# EAGLE design slave_06 (EAGLE 5.08)
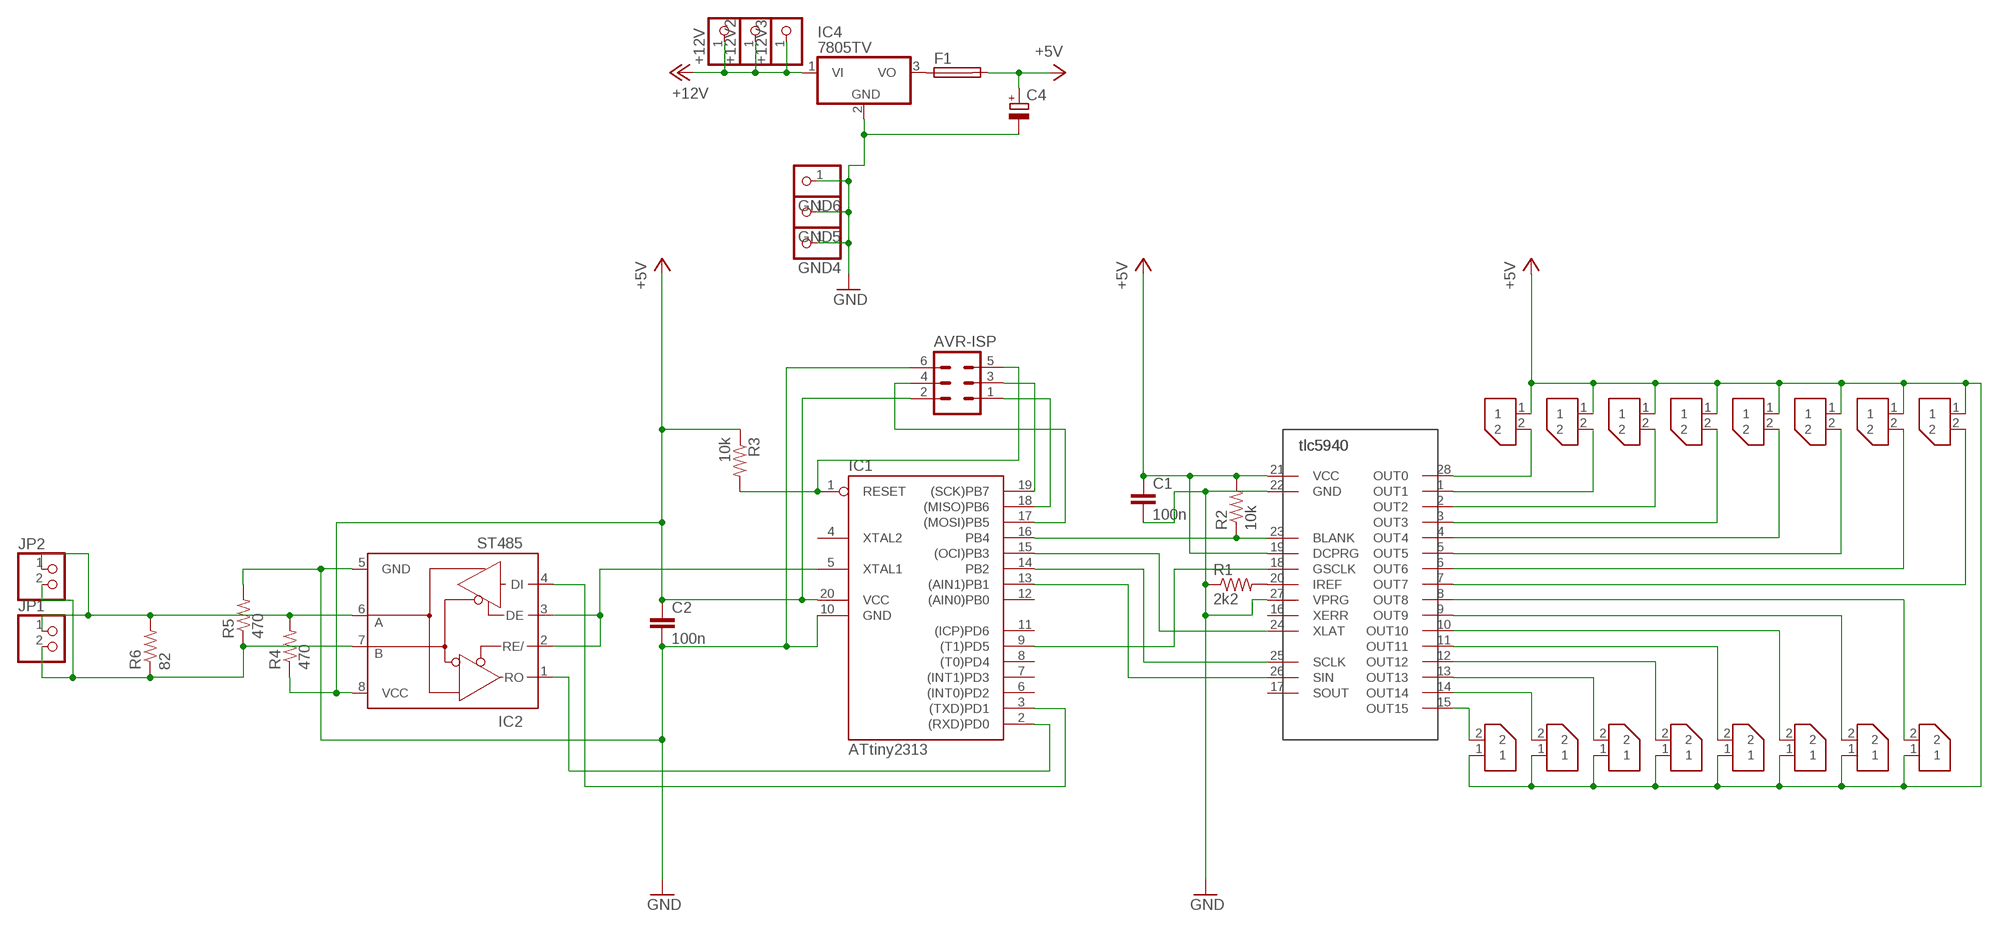
[diagram p0: schematic, sheet 1]

## Parts
+12V  PINHD-1X1  [1X01]
+12V2  PINHD-1X1  [1X01]
+12V3  PINHD-1X1  [1X01]
AVR-ISP  ML6  [ML6]
C1  100n  C7.5/3  [C7.5B3]
C2  100n  C7.5/3  [C7.5B3]
C4  CPOL-EUE5-5  [E5-5]
F1  SH22,5A  [SH22,5A]
GND4  PINHD-1X1  [1X01]
GND5  PINHD-1X1  [1X01]
GND6  PINHD-1X1  [1X01]
IC1  ATtiny2313  AT90S2313P  [DIL20]
IC2  ST485  MAX3468CPA  [DIL08]
IC4  7805TV  [TO220V]
JP1  PINHD-1X2  [1X02]
JP2  PINHD-1X2  [1X02]
R1  2k2  R-US_0204/7  [0204/7]
R2  10k  R-US_0207/10  [0207/10]
R3  10k  R-US_0204/7  [0204/7]
R4  470  R-US_0204/7  [0204/7]
R5  470  R-US_0204/7  [0204/7]
R6  82  R-US_0204/7  [0204/7]
U$1  TLC5940-NT  [28-DIL-300]
U$2  MOLEX-SPOX-HEADER-2-RA  [SPOX-WTB-HEADER-2-RA]
U$3  MOLEX-SPOX-HEADER-2-RA  [SPOX-WTB-HEADER-2-RA]
U$4  MOLEX-SPOX-HEADER-2-RA  [SPOX-WTB-HEADER-2-RA]
U$5  MOLEX-SPOX-HEADER-2-RA  [SPOX-WTB-HEADER-2-RA]
U$6  MOLEX-SPOX-HEADER-2-RA  [SPOX-WTB-HEADER-2-RA]
U$7  MOLEX-SPOX-HEADER-2-RA  [SPOX-WTB-HEADER-2-RA]
U$8  MOLEX-SPOX-HEADER-2-RA  [SPOX-WTB-HEADER-2-RA]
U$9  MOLEX-SPOX-HEADER-2-RA  [SPOX-WTB-HEADER-2-RA]
U$10  MOLEX-SPOX-HEADER-2-RA  [SPOX-WTB-HEADER-2-RA]
U$11  MOLEX-SPOX-HEADER-2-RA  [SPOX-WTB-HEADER-2-RA]
U$12  MOLEX-SPOX-HEADER-2-RA  [SPOX-WTB-HEADER-2-RA]
U$13  MOLEX-SPOX-HEADER-2-RA  [SPOX-WTB-HEADER-2-RA]
U$14  MOLEX-SPOX-HEADER-2-RA  [SPOX-WTB-HEADER-2-RA]
U$15  MOLEX-SPOX-HEADER-2-RA  [SPOX-WTB-HEADER-2-RA]
U$16  MOLEX-SPOX-HEADER-2-RA  [SPOX-WTB-HEADER-2-RA]
U$17  MOLEX-SPOX-HEADER-2-RA  [SPOX-WTB-HEADER-2-RA]

## Nets
+5V: AVR-ISP.2 C1.1 C2.1 C4.+ F1.2 IC1.20(VCC) IC2.8(VCC) R2.2 R3.1 R4.1 U$1.19(DCPRG) U$1.21(VCC) U$2.1 U$3.1 U$4.1 U$5.1 U$6.1 U$7.1 U$8.1 U$9.1 U$10.1 U$11.1 U$12.1 U$13.1 U$14.1 U$15.1 U$16.1 U$17.1
+12V1: +12V2.1 +12V3.1 +12V.1 IC4.1(VI) ; supply symbol labelled +12V
GND: AVR-ISP.6 C1.2 C2.2 C4.- GND4.1 GND5.1 GND6.1 IC1.10(GND) IC2.5(GND) IC4.2(GND) R1.1 R5.2 U$1.22(GND) U$1.27(VPRG)
N$1: IC1.15((OCI)PB3) U$1.24(XLAT)
N$2: IC1.16(PB4) R2.1 U$1.23(BLANK)
N$3: IC1.9((T1)PD5) U$1.18(GSCLK)
N$4: IC1.14(PB2) U$1.25(SCLK)
N$5: IC1.13((AIN1)PB1) U$1.26(SIN)
N$6: R1.2 U$1.20(IREF)
N$7: IC1.3((TXD)PD1) IC2.4(DI)
N$8: AVR-ISP.1 IC1.18((MISO)PB6)
N$10: IC1.2((RXD)PD0) IC2.1(RO)
N$11: AVR-ISP.3 IC1.19((SCK)PB7)
N$12: F1.1 IC4.3(VO)
N$13: U$1.28(OUT0) U$2.2
N$14: AVR-ISP.4 IC1.17((MOSI)PB5)
N$15: U$1.1(OUT1) U$3.2
N$16: U$1.2(OUT2) U$4.2
N$17: U$1.3(OUT3) U$5.2
N$18: U$1.15(OUT15) U$10.2
N$19: U$1.14(OUT14) U$11.2
N$20: U$1.13(OUT13) U$12.2
N$21: U$1.12(OUT12) U$13.2
N$22: U$1.11(OUT11) U$14.2
N$23: U$1.10(OUT10) U$15.2
N$24: U$1.9(OUT9) U$16.2
N$25: U$1.8(OUT8) U$17.2
N$26: U$1.4(OUT4) U$6.2
N$27: U$1.5(OUT5) U$7.2
N$28: U$1.6(OUT6) U$8.2
N$29: U$1.7(OUT7) U$9.2
N$31: AVR-ISP.5 IC1.1(RESET) R3.2
N$32: IC2.7(B) JP1.2 JP2.2 R5.1 R6.1
N$35: IC2.6(A) JP1.1 JP2.1 R4.2 R6.2
N$36: IC1.5(XTAL1) IC2.2(RE/) IC2.3(DE)
Unconnected: IC1.4(XTAL2) IC1.6((INT0)PD2) IC1.7((INT1)PD3) IC1.8((T0)PD4) IC1.11((ICP)PD6) IC1.12((AIN0)PB0) U$1.16(XERR) U$1.17(SOUT)

## Library data of the parts
+12V +12V2 +12V3 GND4-GND6 = pinhead:PINHD-1X1: PIN HEADER
AVR-ISP = con-harting-ml:ML6: HARTING
C1 C2 = capacitor-wima:C: CAPACITOR naming: grid - package width
C4 = resistor:CPOL-EU: POLARIZED CAPACITOR, European symbol
F1 = fuse:SH22,5A: FUSE HOLDER grid 22,5mm, isolated cap OGN0031 8201, Schurter (Buerklin)
IC1 = atmel:AT90S2313: MICROCONTROLLER 2 Kbytes FLASH 128 bytes SRAM 128 bytes EEPROM UART
IC2 = maxim:MAX34*: +5V, Fail-Safe, 40Mbps, Profibus RS-485/RS-422 Transceivers Source: MAX3465-MAX3469.pdf
IC4 = linear:78*: Positive VOLTAGE REGULATOR Source: http://cache.national.com/ds/LM/LM78L05.pdf http://www.fairchildsemi.com/ds/LM/LM7805.pdf
JP1 JP2 = pinhead:PINHD-1X2: PIN HEADER
R1-R6 = resistor:R-US_: RESISTOR, American symbol
U$1 = TLC5490:TLC5940-NT
U$2-U$17 = damians_bits:MOLEX-SPOX-HEADER-2-RA: Molex SPOX 22-05-7025 WTB Header, Right-angle, 2 way

## Board
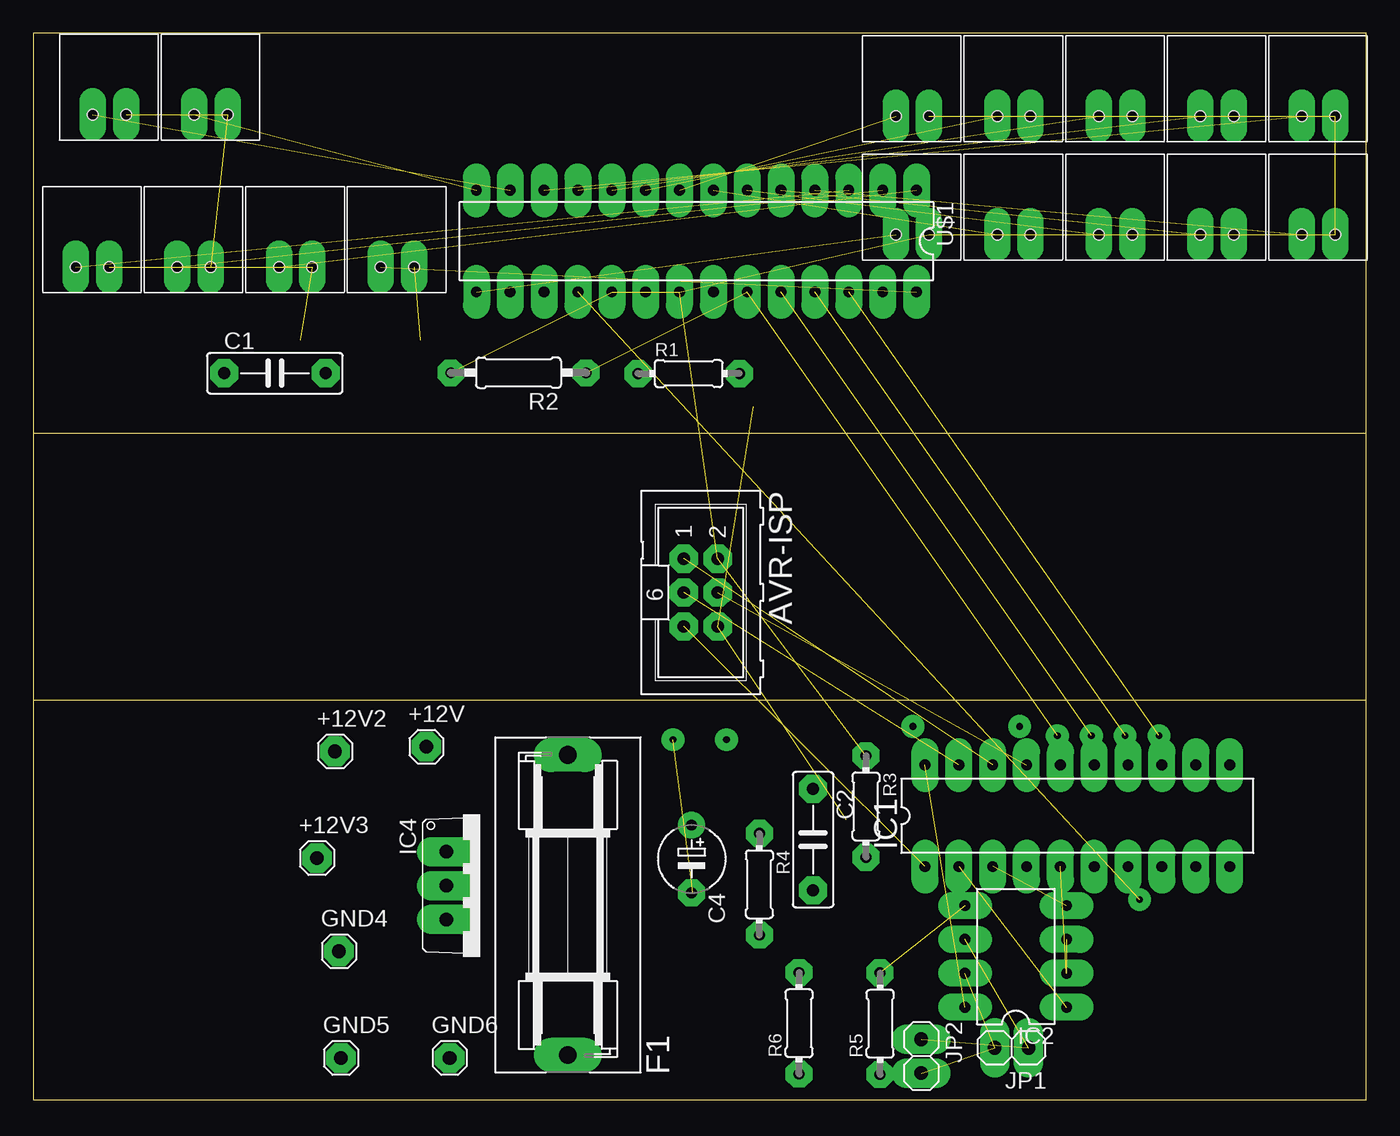
[diagram p1: board, top side]
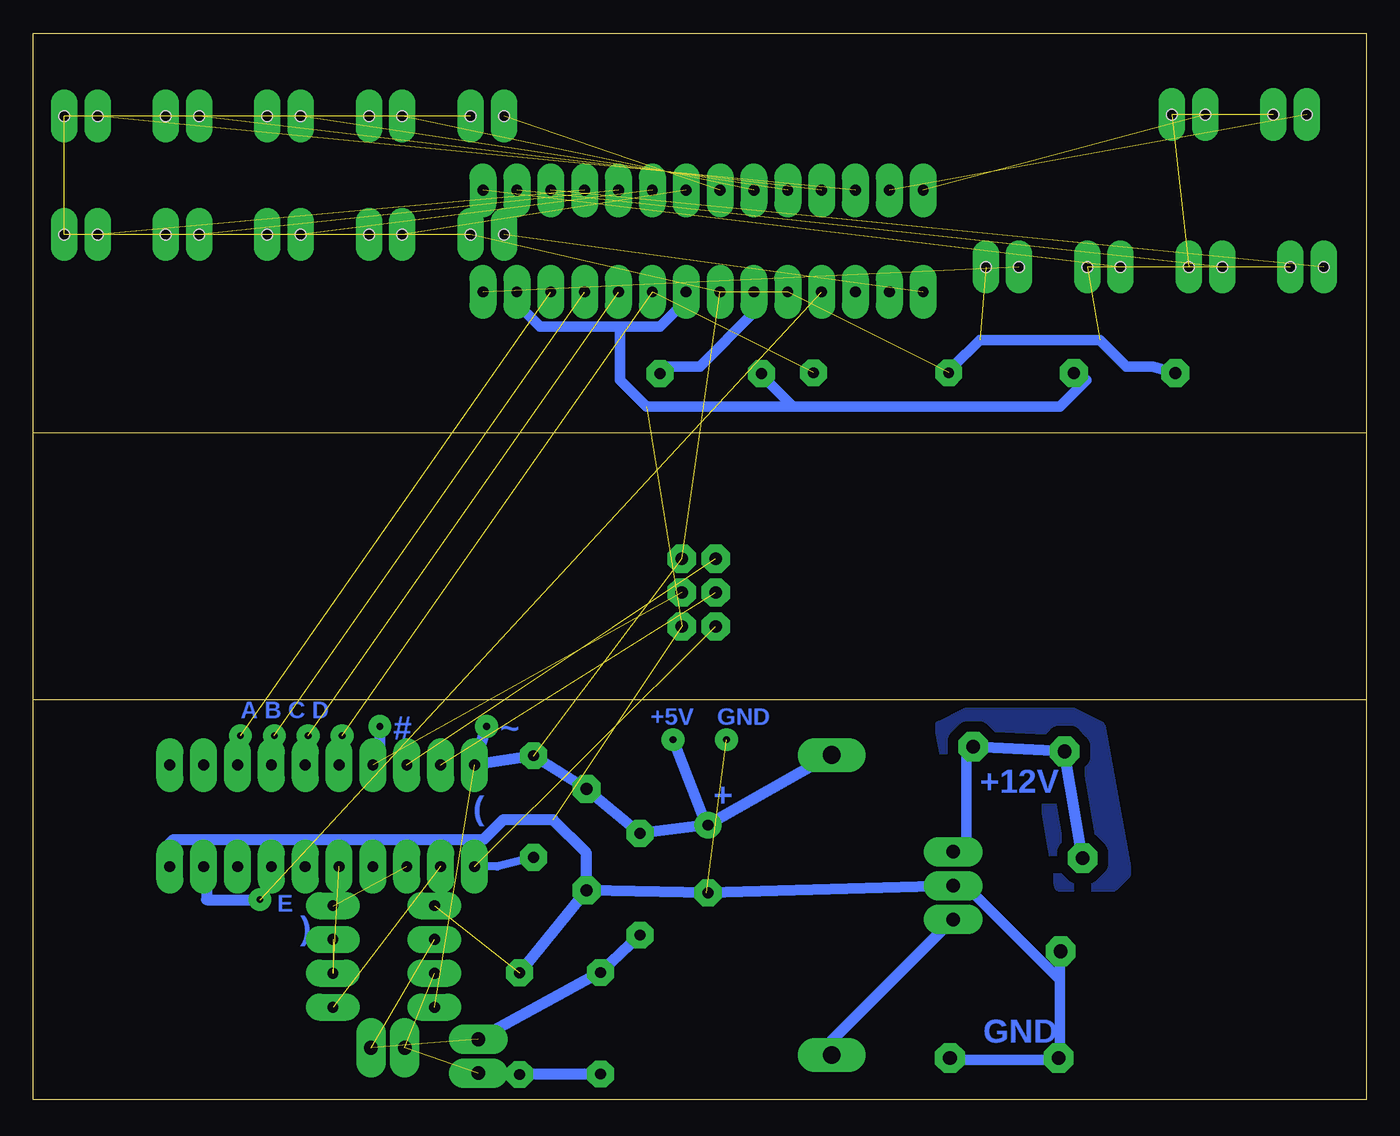
[diagram p2: board, bottom side, seen from below]

Size 100 x 80 mm. Coordinates in mm from the lower left corner, seen from the top.
Outline: 100,30 100,0 0,0 0,30
Outline: 100,30 100,50
Outline: 100,50 100,80 0,80 0,50
Outline: 0,50 0,30
Outline: 0,50 100,50
Outline: 0,30 100,30
Copper layers (1*16): Top 0.035mm / dielectric 1.5mm / Bottom 0.035mm
Design rules "default": minimum track width 0.8mm, minimum drill 0.8mm, track to track 0.8mm, track to pad 0.8mm, pad to pad 0.45mm, via to via 0.8mm, smd to smd 8mil, copper to edge 10mil, drill to drill 8mil, minimum pad ring 0.6mm, minimum via ring 0.6mm, stop-mask expansion 0mil, vias tented up to drill 0mil, thermal gap 10mil

### Footprints (pad centres in the part's own frame; a part is rotated, then mirrored left to right if it is on the bottom)
1X01 = drill 1.016 octagon: 1 0,0
ML6 = drill 0.914 octagon: 1 -2.54,-1.27; 2 -2.54,1.27; 3 0,-1.27; 4 0,1.27; 5 2.54,-1.27; 6 2.54,1.27
C7.5B3 = drill 0.914 pad 1.905 octagon: 1 -3.81,0; 2 3.81,0
E5-5 = drill 0.813 pad 1.905 round: + -2.54,0 | drill 0.813 pad 1.905 octagon: - 2.54,0
SH22,5A = drill 1.321 pad 2.54 long: 1 -11.252,0; 2 11.252,0
DIL20 = drill 0.813 long: 1 -11.43,-3.81; 2 -8.89,-3.81; 3 -6.35,-3.81; 4 -3.81,-3.81; 5 -1.27,-3.81; 6 1.27,-3.81; 7 3.81,-3.81; 8 6.35,-3.81; 9 8.89,-3.81; 10 11.43,-3.81; 11 11.43,3.81; 12 8.89,3.81; 13 6.35,3.81; 14 3.81,3.81; 15 1.27,3.81; 16 -1.27,3.81; 17 -3.81,3.81; 18 -6.35,3.81; 19 -8.89,3.81; 20 -11.43,3.81
DIL08 = drill 0.813 long: 1 -3.81,-3.81; 2 -1.27,-3.81; 3 1.27,-3.81; 4 3.81,-3.81; 5 3.81,3.81; 6 1.27,3.81; 7 -1.27,3.81; 8 -3.81,3.81
TO220V = drill 1.016 long: 1 -2.54,-2.54; 2 0,-2.54; 3 2.54,-2.54
1X02 = drill 1.016 long: 1 -1.27,0; 2 1.27,0
0204/7 = drill 0.813 octagon: 1 -3.81,0; 2 3.81,0
0207/10 = drill 0.813 octagon: 1 -5.08,0; 2 5.08,0
28-DIL-300 = drill 0.813 long: 1 -15.24,-3.81; 2 -12.7,-3.81; 3 -10.16,-3.81; 4 -7.62,-3.81; 5 -5.08,-3.81; 6 -2.54,-3.81; 7 0,-3.81; 8 2.54,-3.81; 9 5.08,-3.81; 10 7.62,-3.81; 11 10.16,-3.81; 12 12.7,-3.81; 13 15.24,-3.81; 14 17.78,-3.81; 15 17.78,3.81; 16 15.24,3.81; 17 12.7,3.81; 18 10.16,3.81; 19 7.62,3.81; 20 5.08,3.81; 21 2.54,3.81; 22 0,3.81; 23 -2.54,3.81; 24 -5.08,3.81; 25 -7.62,3.81; 26 -10.16,3.81; 27 -12.7,3.81; 28 -15.24,3.81
SPOX-WTB-HEADER-2-RA = drill 0.8 long: 1 1.19,0.56; 2 -1.31,0.56 | hole 0.8: -1.31,0.56; 1.19,0.56

### Placement (x,y rotation side)
+12V  29.49,26.47 0 top
+12V2  22.63,26.12 0 top
+12V3  21.28,18.12 0 top
AVR-ISP  50.08,38.04 270 top
C1  18.12,54.5 0 top
C2  58.5,19.5 270 top
C4  49.39,18.05 270 top
F1  40.11,14.6 90 top
GND4  22.93,11.12 0 top
GND5  23.08,3.12 0 top
GND6  31.23,3.12 0 top
IC1  78.33,21.29 0 top
IC2  73.71,10.74 90 top
IC4  33.53,16.05 270 top
JP1  73.4,3.88 180 top
JP2  66.62,3.25 270 top
R1  49.17,54.47 0 top
R2  36.4,54.53 180 top
R3  62.47,21.99 270 top
R4  54.47,16.15 270 top
R5  63.53,5.69 90 top
R6  57.45,5.72 90 top
U$1  51.02,64.41 180 top
U$2  27.36,61.91 0 top
U$3  19.74,61.91 0 top
U$4  12.12,61.91 0 top
U$5  4.5,61.91 0 top
U$6  96.49,64.34 0 top
U$7  88.87,64.34 0 top
U$8  81.25,64.34 0 top
U$9  73.63,64.34 0 top
U$10  66.01,64.34 0 top
U$11  13.39,73.34 0 top
U$12  5.77,73.34 0 top
U$13  96.49,73.23 0 top
U$14  88.87,73.23 0 top
U$15  81.25,73.23 0 top
U$16  73.63,73.23 0 top
U$17  66.01,73.23 0 top

### Tracks (layer width: path | path; a pad name or v marks a point on that pad's centre or on a via)
+5V  (21 unrouted)
  Bottom 0.8: C1.1 16,55 18,55 20,57 29,57 31,55 R2.2
  Bottom 0.813: F1.2 C4.+ R4.1 C2.1 R3.1 IC1.20 66,28
+12V1
  Bottom 0.8: IC4.1 30,19 30,26 +12V.1
  Bottom 0.813: +12V3.1 +12V2.1 +12V.1
GND  (3 unrouted)
  Bottom 0.8: 56,58 62,58 64,60 U$1.27 | 56,58 53,58 51,60 U$1.22 | 43,52 45,54 R1.1 | 43,52 23,52 21,54 C1.2 | 56,58 56,54 54,52 43,52 | 23,9 23,11 GND4.1 | 23,9 23,4 GND5.1 24,3 31,3 GND6.1 | 23,9 30,16 IC4.2
  Bottom 0.813: IC4.2 C4.- C2.2 | IC1.10 90,17.72 90,19 89.5,19.5 66.25,19.5 64.75,21 61,21 58.5,18.5 C2.2 | C2.2 R5.2
N$1  (via drill 0.51)  (1 unrouted)
  Bottom 0.813: IC1.15 79.38,25.32 v79.38,27.3
N$2  (via drill 0.51)  (2 unrouted)
  Bottom 0.813: IC1.16 76.83,25.32 v76.83,27.3
N$3  (1 unrouted)
  Bottom 0.813: IC1.9 87,17.26 87,15 83,15
N$4  (via drill 0.51)  (1 unrouted)
  Bottom 0.813: IC1.14 81.92,25.32 v81.92,27.3
N$5  (via drill 0.51)  (1 unrouted)
  Bottom 0.813: IC1.13 84.45,25.32 v84.45,27.3
N$6
  Bottom 0.8: R1.2 53,55 50,55 46,59 46,60 U$1.20
N$7  (1 unrouted)
N$8  (1 unrouted)
N$10  (1 unrouted)
N$11  (1 unrouted)
N$12
  Bottom 0.813: IC4.3 40.11,4.39 F1.1
N$13  (1 unrouted)
N$14  (1 unrouted)
  Bottom 0.813: IC1.17 74,25.62 74,28
N$15  (1 unrouted)
N$16  (1 unrouted)
N$17  (1 unrouted)
N$18  (1 unrouted)
N$19  (1 unrouted)
N$20  (1 unrouted)
N$21  (1 unrouted)
N$22  (1 unrouted)
N$23  (1 unrouted)
N$24  (1 unrouted)
N$25  (1 unrouted)
N$26  (1 unrouted)
N$27  (1 unrouted)
N$28  (1 unrouted)
N$29  (1 unrouted)
N$30  (via drill 0.51)
  other vias: 66,28
N$31  (1 unrouted)
  Bottom 0.61: R3.2 65.17,17.48 IC1.1
N$32  (2 unrouted)
  Bottom 0.813: JP2.2 66.52,1.88 R5.1 R6.1
N$33  (via drill 0.51)
  other vias: 74,28
N$34
  pour Bottom: 19,16 23,16 24,22 31,23 32,28 30,29 22,29 20,28 18,17
N$35  (2 unrouted)
  Bottom 0.813: JP2.1 R6.2 R4.2
N$36  (2 unrouted)
N$37  (via drill 0.51)
  other vias: 83,15
N$38  (via drill 0.51)
  Bottom 0.813: v52,27 49.5,20.5
N$39  (via drill 0.51)  (1 unrouted)
  other vias: 48,27

### Text on the board
Bottom: A B C D | GND | +5V | ~ | # | +12V | + | ( | E | ) | GND